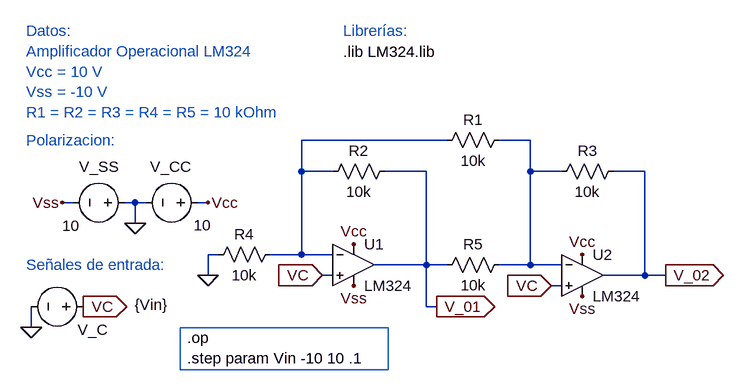
[diagram p0: schematic Lab_1_Circ_1_VC.asc]
Lab_1_Circ_1_VC.asc, the LTspice schematic file:
Version 4
SHEET 1 1560 680
WIRE 48 -208 -176 -208
WIRE 176 -208 128 -208
WIRE -176 -160 -176 -208
WIRE -128 -160 -176 -160
WIRE 16 -160 -48 -160
WIRE 176 -160 176 -208
WIRE 224 -160 176 -160
WIRE 352 -160 304 -160
WIRE -528 -112 -544 -112
WIRE -432 -112 -448 -112
WIRE -416 -112 -432 -112
WIRE -320 -112 -336 -112
WIRE -432 -80 -432 -112
WIRE -304 -32 -320 -32
WIRE -176 -32 -176 -160
WIRE -176 -32 -224 -32
WIRE -128 -32 -176 -32
WIRE 16 -16 16 -160
WIRE 16 -16 -64 -16
WIRE 48 -16 16 -16
WIRE 176 -16 176 -160
WIRE 176 -16 128 -16
WIRE 224 -16 176 -16
WIRE -320 0 -320 -32
WIRE -128 0 -144 0
WIRE 352 0 352 -160
WIRE 352 0 288 0
WIRE 384 0 352 0
WIRE 224 16 208 16
WIRE 16 48 16 -16
WIRE 32 48 16 48
WIRE -592 80 -592 48
FLAG -320 0 0
FLAG -320 -112 Vcc
FLAG -96 -48 Vcc
FLAG 256 -32 Vcc
FLAG -544 -112 Vss
FLAG -96 16 Vss
FLAG 256 32 Vss
FLAG -432 -80 0
FLAG -592 80 0
FLAG 32 48 V_01
IOPIN 32 48 Out
FLAG 384 0 V_02
IOPIN 384 0 Out
FLAG -144 0 VC
IOPIN -144 0 In
FLAG 208 16 VC
IOPIN 208 16 In
FLAG -512 48 VC
IOPIN -512 48 Out
SYMBOL OpAmps\\opamp2 -96 -80 R0
SYMATTR InstName U1
SYMATTR Value LM324
SYMBOL OpAmps\\opamp2 256 -64 R0
SYMATTR InstName U2
SYMATTR Value LM324
SYMBOL res 144 -224 R90
WINDOW 0 0 56 VBottom 2
WINDOW 3 32 56 VTop 2
SYMATTR InstName R1
SYMATTR Value 10k
SYMBOL res -32 -176 R90
WINDOW 0 0 56 VBottom 2
WINDOW 3 32 56 VTop 2
SYMATTR InstName R2
SYMATTR Value 10k
SYMBOL res 320 -176 R90
WINDOW 0 0 56 VBottom 2
WINDOW 3 32 56 VTop 2
SYMATTR InstName R3
SYMATTR Value 10k
SYMBOL res -208 -48 R90
WINDOW 0 0 56 VBottom 2
WINDOW 3 32 56 VTop 2
SYMATTR InstName R4
SYMATTR Value 10k
SYMBOL res 144 -32 R90
WINDOW 0 0 56 VBottom 2
WINDOW 3 32 56 VTop 2
SYMATTR InstName R5
SYMATTR Value 10k
SYMBOL voltage -320 -112 R90
WINDOW 0 -55 25 VRight 2
WINDOW 3 35 -5 VRight 2
WINDOW 123 0 0 Left 0
WINDOW 39 0 0 Left 0
SYMATTR InstName V_CC
SYMATTR Value 10
SYMBOL voltage -432 -112 R90
WINDOW 0 -55 25 VRight 2
WINDOW 3 36 85 VRight 2
WINDOW 123 0 0 Left 0
WINDOW 39 0 0 Left 0
SYMATTR InstName V_SS
SYMATTR Value 10
SYMBOL voltage -496 48 R90
WINDOW 0 36 -22 VRight 2
WINDOW 3 -3 -114 VRight 2
WINDOW 123 0 0 Left 0
WINDOW 39 0 0 Left 0
SYMATTR InstName V_C
SYMATTR Value {Vin}
TEXT -112 -344 Left 2 !.lib LM324.lib
TEXT -112 -376 Left 2 ;Librerías:
TEXT -600 -208 Left 2 ;Polarizacion:
TEXT -600 -16 Left 2 ;Señales de entrada:
TEXT -600 -376 Left 2 ;Datos:\nAmplificador Operacional LM324\nVcc = 10 V\nVss = -10 V\nR1 = R2 = R3 = R4 = R5 = 10 kOhm
TEXT -352 96 Left 2 !.op\n.step param Vin -10 10 .1
RECTANGLE Normal -43 145 -363 81

The netlist it stands for:
* Lab_1_Circ_1_VC.asc
XU1 VC N001 Vcc Vss V_01 LM324  ; pins In+ In- V+ V- OUT
XU2 VC N002 Vcc Vss V_02 LM324  ; pins In+ In- V+ V- OUT
R1 N002 N001 10k
R2 V_01 N001 10k
R3 V_02 N002 10k
R4 N001 0 10k
R5 N002 V_01 10k
V_CC Vcc 0 10
V_SS 0 Vss 10
V_C VC 0 {Vin}
.lib LM324.lib
* Librerías:
* Polarizacion:
* Señales de entrada:
* Datos:
* Amplificador Operacional LM324
* Vcc = 10 V
* Vss = -10 V
* R1 = R2 = R3 = R4 = R5 = 10 kOhm
.op
.step param Vin -10 10 .1
.backanno
.end

* Results of the author's LTspice run, read from the files saved beside the schematic
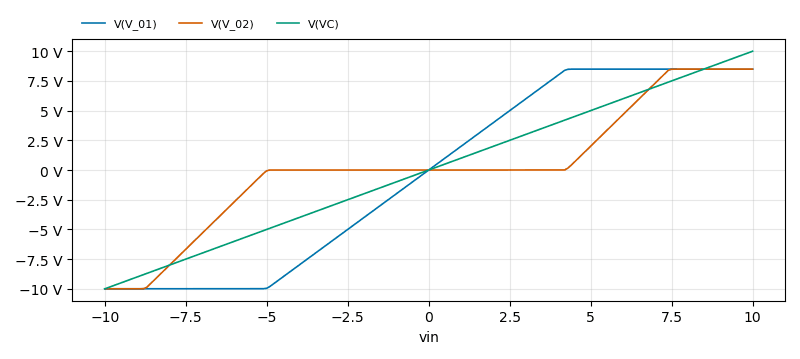
[diagram p1: Operating Point of Lab_1_Circ_1_VC.asc, plotted from the saved traces]
* Operating Point, 1 run:
*   V(V_01): -9.996 V at vin=-10 , 8.495 V at vin=10 , min -9.996 V, max 8.495 V
*   V(V_02): -9.996 V at vin=-10 , 8.494 V at vin=10 , min -9.996 V, max 8.494 V
*   V(VC): -10 V at vin=-10 , 10 V at vin=10 , min -10 V, max 10 V